# Altium schematic sheet [05] - BUTTONS AND SWITCHES.SchDoc
size A4; DocumentNumber: 5; SheetNumber: 5; SheetTotal: 5
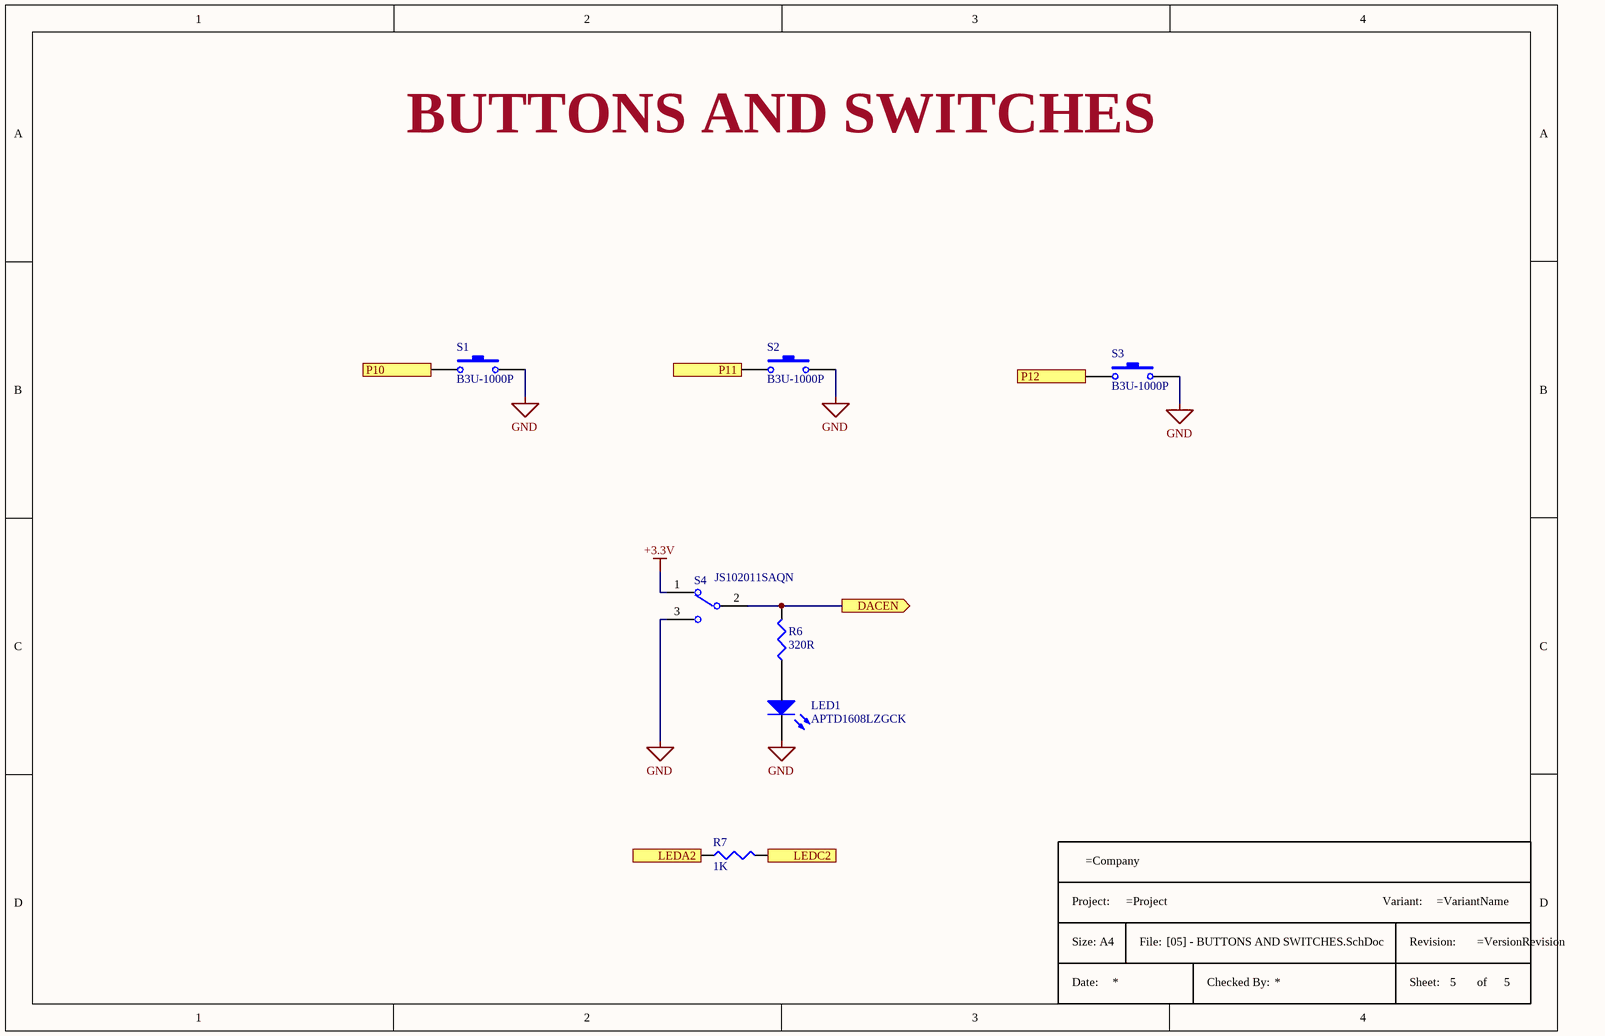
[diagram p0: [05] - BUTTONS AND SWITCHES.SchDoc]

## Parts
*  Title Block A4  (value not drawn)  (graphical)
LED1  APTD1608LZGCK  [RESC0603X55N]
R6  320R  [R0603]
R7  1K  [R0603]
S1  B3U-1000P  [SW_B3U-1000P]
S2  B3U-1000P  [SW_B3U-1000P]
S3  B3U-1000P  [SW_B3U-1000P]
S4  JS102011SAQN  [SW_JS102011SAQN]

## Ports
DACEN (out), LEDA2 (in), LEDC2 (in), P10 (out), P11 (out), P12 (out)

## Nets
+3.3V: S4.1
GND: LED1.1(K) S1.2 S2.2 S3.2 S4.3
DACEN: R6.2 S4.2 ; port DACEN
LEDA2: R7.1 ; port LEDA2
LEDC2: R7.2 ; port LEDC2
P10: S1.1 ; port P10
P11: S2.1 ; port P11
P12: S3.1 ; port P12
NetLED1_2: LED1.2(A) R6.1

## Notes on the sheet
- BUTTONS AND SWITCHES
- (in symbol Title Block A4) Project:; Variant:; Size: A4; File:; Revision:; Date:; Checked By:; Sheet:; of

## Library data of the parts
LED1 = APTD1608LZGCK: LED GREEN CLEAR 0603 SMD; Manufacturer: Kingbright; Lens Color: Colorless; Luminous Intensity: 90mcd; Test Current: 2mA; Viewing Angle: 60°; Dominant Wavelength: 525nm; Forward Voltage: 2.65V; Supplier 1: Mouser; Manufacturer Part Number: APTD1608LZGCK; RoHS: Yes; Category: LEDs; Stock 1: 24112; Pricing 1: 1=0,56000, 10=0,36300, 50=0,36300, 100=0,31700, 1000=0,21000, 10000=0,17900 (USD); Mount: Surface Mount; Case/Package: 0603; Case Code (Imperial): 0603; Color: Green; Case Code (Metric): 1608; Packaging: Cut Tape; Lens Transparency: Clear; Length: 1.6mm; Width: 0.8mm; Height: 0.95mm; ComponentLink1URL: http://www.mouser.com/ds/2/216/APTD1608LZGCK-535846.pdf?src-supplier=Mouser; ComponentLink1Description: http://www.mouser.com/ds/2/216/APTD1608LZGCK-535846.pdf?src-supplier=Mouser; ComponentLink2URL: http://www.kingbrightusa.com/images/catalog/SPEC/APTD1608LZGCK.pdf?src-supplier=Digi-Key; ComponentLink2Description: http://www.kingbrightusa.com/images/catalog/SPEC/APTD1608LZGCK.pdf?src-supplier=Digi-Key; Supplier Part Number 1: 604-APTD1608LZGCK
R6 = RT0603DRE07320RL: High Precision-High Stability Chip Resistor Thin Film 0603 320Ohm 0.5% Paper T/R; Manufacturer: Yageo; Max Power Dissipation: 100mW; Temperature Coefficient: 50ppm/°C; Supplier 1: Mouser; Manufacturer Part Number: RT0603DRE07320RL; RoHS: Yes; Category: Chip SMD Resistors; Stock 1: 3704; Pricing 1: 1=0,14000, 10=0,07400, 50=0,07400, 100=0,02600, 1000=0,01900, 10000=0,01200 (USD); Case/Package: 0603; Min Operating Temperature: -55°C; Max Operating Temperature: 155°C; Resistance: 320R; Tolerance: 0.5%; Resistor Type: Thin Film; Packaging: Tape and Reel; Number of Terminations: 2; ComponentLink1URL: http://www.yageo.com/documents/recent/PYu-RT_1-to-0.01_RoHS_L_9.pdf?src-supplier=Digi-Key; ComponentLink1Description: http://www.yageo.com/documents/recent/PYu-RT_1-to-0.01_RoHS_L_9.pdf?src-supplier=Digi-Key; Supplier Part Number 1: 603-RT0603DRE07320RL
R7 = ESR03EZPF1001: ROHM - ESR03EZPF1001 - SMD Chip Resistor, Anti-Surge, 0603 [1608 Metric], 1 kohm, ESR Series, 150 V, Thick Film, 250 mW; Temperature Coefficient: 100ppm/°C; Max Power Dissipation: 250mW; Resistance: 1kR; Tolerance: 1%; Supplier 1: Mouser; Manufacturer: Rohm; Manufacturer Part Number: ESR03EZPF1001; RoHS: Yes; Category: Chip SMD Resistors; Stock 1: 87852; Pricing 1: 1=0,13000, 10=0,11100, 50=0,11100, 100=0,04400, 1000=0,01700, 10000=0,01100 (USD); Case/Package: 0603; Case Code (Metric): 1608; Case Code (Imperial): 0603; Min Operating Temperature: -55°C; Max Operating Temperature: 155°C; Resistor Type: Thick Film; Number of Terminations: 2; Features: Automotive AEC-Q200; Package Quantity: 1; Power Rating: 250mW; Packaging: Tape and Reel; Length: 0.063inch; Width: 0.031inch; Height: 0.022inch; Lead Free: Lead Free; ComponentLink1URL: https://datasheet.ciiva.com/2469/esr-2469712.pdf?src-supplier=Digi-Key; ComponentLink1Description: https://datasheet.ciiva.com/2469/esr-2469712.pdf?src-supplier=Digi-Key; ComponentLink2URL: https://datasheet.ciiva.com/2469/esr-2469713.pdf?src-supplier=Digi-Key; ComponentLink2Description: https://datasheet.ciiva.com/2469/esr-2469713.pdf?src-supplier=Digi-Key; ComponentLink3URL: https://datasheet.ciiva.com/2469/esr-2469714.pdf?src-supplier=Digi-Key; ComponentLink3Description: https://datasheet.ciiva.com/2469/esr-2469714.pdf?src-supplier=Digi-Key; Supplier Part Number 1: 755-ESR03EZPF1001
S1-S3 = B3U-1000P: SWITCH TACTILE SPST-NO 0.05A 12V; Manufacturer: Omron; Mechanical Life: 200000Cycles; Operating Force: 1.5N; Throw Configuration: SPST; Current Rating: 50mA; Contact Resistance: 100mR; Illumination Type: Non-Illuminated,Illuminated; Switch Travel: 0.15mm; Switch Function: Off-Mom; Actuator Type: Standard; Actuator Length: 0.4mm; Ratings: Dust Proof,IP40; Supplier 1: Mouser; Manufacturer Part Number: B3U-1000P; RoHS: Yes; Category: Tactile Switches; Stock 1: 33691; Pricing 1: 1=0,92000, 10=0,79900, 50=0,79900, 100=0,64500, 1000=0,53800, 10000=0,44100 (USD); Mount: Surface Mount; Weight: 0.000776oz; Contact Material: Silver; Min Operating Temperature: -25°C; Max Operating Temperature: 70°C; Packaging: Tape and Reel; Voltage Rating (DC): 12V; Package Quantity: 1; Max Current Rating: 50mA; Termination: SMD/SMT; Orientation: Straight; Max Voltage Rating (DC): 12V; Electrical Life: 200000Cycles; Insulation Resistance: 100MR; Contact Current Rating: 50mA; Length: 4mm; Width: 3mm; Height: 1.2mm; Depth: 2.5mm; REACH SVHC: Unknown; Lead Free: Lead Free; ComponentLink1URL: https://datasheet.ciiva.com/26917/getdatasheetpartid-552554-26917552.pdf?src-supplier=Verical; ComponentLink1Description: https://datasheet.ciiva.com/26917/getdatasheetpartid-552554-26917552.pdf?src-supplier=Verical; ComponentLink2URL: https://datasheet.ciiva.com/22696/1685550-22696214.pdf?src-supplier=Element14; ComponentLink2Description: https://datasheet.ciiva.com/22696/1685550-22696214.pdf?src-supplier=Element14; ComponentLink3URL: https://datasheet.ciiva.com/1532/1685550-1532680.pdf?src-supplier=Element14; ComponentLink3Description: https://datasheet.ciiva.com/1532/1685550-1532680.pdf?src-supplier=Element14; ComponentLink4URL: https://datasheet.ciiva.com/1634/1685550-1634396.pdf?src-supplier=Farnell; ComponentLink4Description: https://datasheet.ciiva.com/1634/1685550-1634396.pdf?src-supplier=Farnell; ComponentLink5URL: https://datasheet.ciiva.com/14142/b3u-eng-datasheet-14142540.pdf?src-supplier=Distrelec; ComponentLink5Description: https://datasheet.ciiva.com/14142/b3u-eng-datasheet-14142540.pdf?src-supplier=Distrelec; ComponentLink6URL: https://datasheet.ciiva.com/2900/b3u-1110-2900029.pdf?src-supplier=Digi-Key; ComponentLink6Description: https://datasheet.ciiva.com/2900/b3u-1110-2900029.pdf?src-supplier=Digi-Key; ComponentLink7URL: https://datasheet.ciiva.com/16155/en-b3u-16155021.pdf?src-supplier=Onlinecomponents.com; ComponentLink7Description: https://datasheet.ciiva.com/16155/en-b3u-16155021.pdf?src-supplier=Onlinecomponents.com; ComponentLink8URL: https://datasheet.ciiva.com/2900/b3u-1110-2900030.pdf?src-supplier=Digi-Key; ComponentLink8Description: https://datasheet.ciiva.com/2900/b3u-1110-2900030.pdf?src-supplier=Digi-Key; ComponentLink9URL: https://datasheet.ciiva.com/16862/70176037-16862846.pdf?src-supplier=Allied+Electronics; ComponentLink9Description: https://datasheet.ciiva.com/16862/70176037-16862846.pdf?src-supplier=Allied+Electronics; ComponentLink10URL: https://datasheet.ciiva.com/2900/b3u-1110-2900031.pdf?src-supplier=Digi-Key; ComponentLink10Description: https://datasheet.ciiva.com/2900/b3u-1110-2900031.pdf?src-supplier=Digi-Key; Supplier Part Number 1: 653-B3U-1000P
S4 = JS102011SAQN: Slide Switch, JS Series, SPDT, Right Angle, SMD, 100 mA ;RoHS Compliant: Yes; Manufacturer: ITT C&K; Actuator Material: Nylon,Polyamide; Max Voltage Rating (DC): 6V; Max Current Rating: 300mA; Contact Resistance: 70mR; Electrical Life: 5000Cycles; Illumination Type: Non-Illuminated; Switch Travel: 2mm; Switch Function: On-On; Actuator Type: Standard; Supplier 1: Mouser; Manufacturer Part Number: JS102011SAQN; RoHS: Yes; Category: Slide Switches; Stock 1: 8122; Pricing 1: 1=0,51000, 10=0,51000, 50=0,47600, 100=0,46200, 1000=0,31600, 10000=0,29200 (USD); Mount: Surface Mount; Case/Package: 100; Contact Material: Copper Alloy,Copper,Silver; Contact Plating: Silver; Housing Material: Nylon; Min Operating Temperature: -40°C; Max Operating Temperature: 85°C; Throw Configuration: SPDT; Termination: Gull Wing; Packaging: Tape and Reel; Voltage Rating (DC): 6V; Package Quantity: 1; Current Rating: 300mA; Contact Current Rating: 300mA; Orientation: Right Angle; Length: 9mm; Actuator Length: 2mm; Radiation Hardening: No; REACH SVHC: No SVHC; Lead Free: Lead Free; ComponentLink1URL: https://datasheet.ciiva.com/1532/js-9dec14-1532400.pdf?src-supplier=Element14; ComponentLink1Description: https://datasheet.ciiva.com/1532/js-9dec14-1532400.pdf?src-supplier=Element14; ComponentLink2URL: https://datasheet.ciiva.com/16442/js102011saqn-16442775.pdf?src-supplier=Future+Electronics; ComponentLink2Description: https://datasheet.ciiva.com/16442/js102011saqn-16442775.pdf?src-supplier=Future+Electronics; ComponentLink3URL: https://datasheet.ciiva.com/5279/js-1nov12-221285-5279564.pdf?src-supplier=Mouser; ComponentLink3Description: https://datasheet.ciiva.com/5279/js-1nov12-221285-5279564.pdf?src-supplier=Mouser; ComponentLink4URL: https://datasheet.ciiva.com/18147/getdatasheetpartid-313004-18147207.pdf?src-supplier=Verical; ComponentLink4Description: https://datasheet.ciiva.com/18147/getdatasheetpartid-313004-18147207.pdf?src-supplier=Verical; ComponentLink5URL: https://datasheet.ciiva.com/2889/js-9dec14-2889130.pdf?src-supplier=Digi-Key; ComponentLink5Description: https://datasheet.ciiva.com/2889/js-9dec14-2889130.pdf?src-supplier=Digi-Key; ComponentLink6URL: https://datasheet.ciiva.com/8625/js-9dec14-8625466.pdf?src-supplier=Avnet; ComponentLink6Description: https://datasheet.ciiva.com/8625/js-9dec14-8625466.pdf?src-supplier=Avnet; ComponentLink7URL: https://datasheet.ciiva.com/2889/js-9dec14-2889131.pdf?src-supplier=Digi-Key; ComponentLink7Description: https://datasheet.ciiva.com/2889/js-9dec14-2889131.pdf?src-supplier=Digi-Key; ComponentLink8URL: https://datasheet.ciiva.com/2889/js-9dec14-2889132.pdf?src-supplier=Digi-Key; ComponentLink8Description: https://datasheet.ciiva.com/2889/js-9dec14-2889132.pdf?src-supplier=Digi-Key; ComponentLink9URL: https://datasheet.ciiva.com/16174/js-3nov11-16174349.pdf?src-supplier=Onlinecomponents.com; ComponentLink9Description: https://datasheet.ciiva.com/16174/js-3nov11-16174349.pdf?src-supplier=Onlinecomponents.com; Supplier Part Number 1: 611-JS102011SAQN